# EAGLE design fio_v1.0 (EAGLE 5.00)
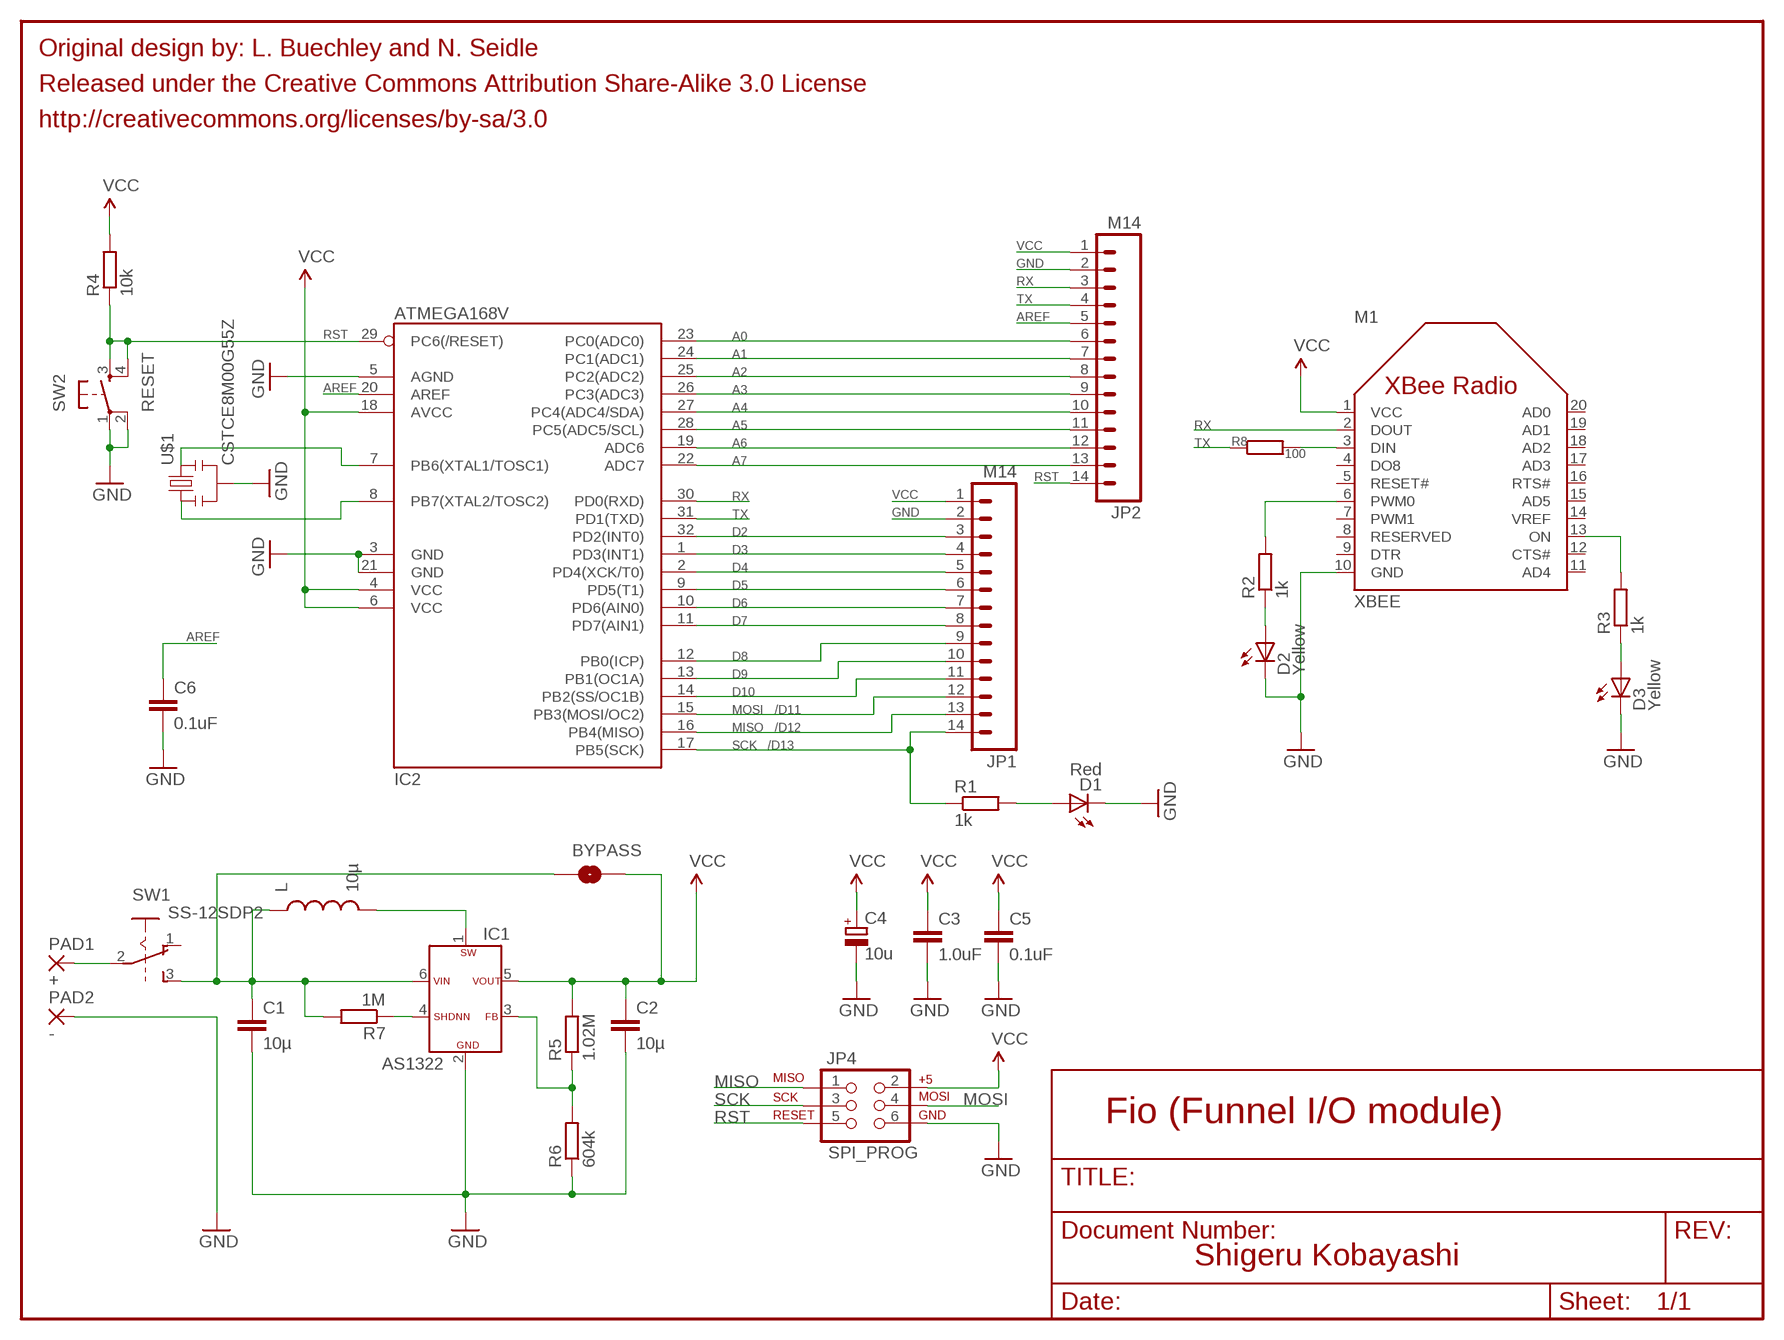
[diagram p0: schematic, sheet 1]

## Parts
BYPASS  SOLDERJUMPERNO  [SJ-NO]
C1  10µ  C-EUC0805K  [C0805K]
C2  10µ  C-EUC0805K  [C0805K]
C3  1.0uF  CAP0603  [0603]
C4  10u  CPOL-EUC  [PANASONIC_C]
C5  0.1uF  CAP0603  [0603]
C6  0.1uF  CAP0603  [0603]
D1  Red  LEDCHIPLED_0805  [CHIPLED_0805]
D2  Yellow  LEDCHIPLED_0805  [CHIPLED_0805]
D3  Yellow  LEDCHIPLED_0805  [CHIPLED_0805]
IC1  AS1322  [SOT23-6]
IC2  ATMEGA168V  ATMEGA168  [TQFP32-08]
JP1  M14  [1X14]
JP2  M14  [1X14]
JP4  SPI_PROG  AVR_SPI_PRG_6NS  [2X3-NS]
L  10µ  A921CY  [D63LCB]
M1  XBEE  [XBEE]
PAD1  +  2,54/1,0  [2,54/1,0]
PAD2  -  2,54/1,0  [2,54/1,0]
R1  1k  R-EU_R0603  [R0603]
R2  1k  R-EU_R0603  [R0603]
R3  1k  R-EU_R0603  [R0603]
R4  10k  R-EU_R0603  [R0603]
R5  1.02M  R-EU_R0603  [R0603]
R6  604k  R-EU_R0603  [R0603]
R7  1M  R-EU_R0603  [R0603]
R8  100  R-EU_R0603  [R0603]
SW1  SS-12SDP2  [SS-12SDP2]
SW2  RESET  OMRON_B3SN-3012  [B3SN-3012]
U$1  CSTCE8M00G55Z  RESONATORSMD  [RESONATOR-SMD]

## Nets
A0: IC2.23(PC0(ADC0)) JP2.6
A1: IC2.24(PC1(ADC1)) JP2.7
A2: IC2.25(PC2(ADC2)) JP2.8
A3: IC2.26(PC3(ADC3)) JP2.9
A4: IC2.27(PC4(ADC4/SDA)) JP2.10
A5: IC2.28(PC5(ADC5/SCL)) JP2.11
A6: IC2.19(ADC6) JP2.12
A7: IC2.22(ADC7) JP2.13
AREF: C6.1 IC2.20(AREF) JP2.5
D2: IC2.32(PD2(INT0)) JP1.3
D3: IC2.1(PD3(INT1)) JP1.4
D4: IC2.2(PD4(XCK/T0)) JP1.5
D5: IC2.9(PD5(T1)) JP1.6
D6: IC2.10(PD6(AIN0)) JP1.7
D7: IC2.11(PD7(AIN1)) JP1.8
D8: IC2.12(PB0(ICP)) JP1.9
D9: IC2.13(PB1(OC1A)) JP1.10
D10: IC2.14(PB2(SS/OC1B)) JP1.11
GND: C1.2 C2.2 C3.2 C4.- C5.2 C6.2 D1.C D2.C D3.C IC1.2(GND) IC2.3(GND) IC2.5(AGND) IC2.21(GND) JP1.2 JP2.2 JP4.6 M1.10(GND) PAD2.1(P) R6.1 SW2.1 SW2.2 U$1.2
MISO: IC2.16(PB4(MISO)) JP1.13 JP4.1
MOSI: IC2.15(PB3(MOSI/OC2)) JP1.12 JP4.4
N$1: M1.13(ON) R3.2
N$2: D1.A R1.2
N$3: D2.A R2.1
N$4: M1.6(PWM0) R2.2
N$5: PAD1.1(P) SW1.2(P)
N$6: D3.A R3.1
N$7: M1.3(DIN) R8.2
N$10: IC2.7(PB6(XTAL1/TOSC1)) U$1.3
N$11: IC1.3(FB) R5.1 R6.2
N$12: IC2.8(PB7(XTAL2/TOSC2)) U$1.1
N$13: BYPASS.1 C1.1 IC1.6(VIN) L.P$1 R7.2 SW1.3(S)
N$14: IC1.1(SW) L.P$2
N$15: IC1.4(SHDNN) R7.1
RST: IC2.29(PC6(/RESET)) JP2.14 JP4.5 R4.1 SW2.3 SW2.4
RX: IC2.30(PD0(RXD)) JP2.3 M1.2(DOUT)
SCK: IC2.17(PB5(SCK)) JP1.14 JP4.3 R1.1
TX: IC2.31(PD1(TXD)) JP2.4 R8.1
VCC [VCC]: BYPASS.2 C2.1 C3.1 C4.+ C5.1 IC1.5(VOUT) IC2.4(VCC) IC2.6(VCC) IC2.18(AVCC) JP1.1 JP2.1 JP4.2 M1.1(VCC) R4.2 R5.2
Unconnected: M1.4(DO8) M1.5(RESET#) M1.7(PWM1) M1.8(RESERVED) M1.9(DTR) M1.11(AD4) M1.12(CTS#) M1.14(VREF) M1.15(AD5) M1.16(RTS#) M1.17(AD3) M1.18(AD2) M1.19(AD1) M1.20(AD0) SW1.1(O)

## Notes on the sheet
- Original design by: L. Buechley and N. Seidle
- Released under the Creative Commons Attribution Share-Alike 3.0 License
- http://creativecommons.org/licenses/by-sa/3.0
- /D11
- /D12
- /D13
- Fio (Funnel I/O module)
- Shigeru Kobayashi

## Library data of the parts
BYPASS = SparkFun:SOLDERJUMPER: Solder Jumper Standard SMD solder jumper. Used to automate production. Two varients : Normally Open and Normally Closed are the same, but have different paste layers. NC will have a large amount of paste and should jumper during reflow.
C1 C2 = rcl:C-EU: CAPACITOR, European symbol
C3 C5 C6 = SparkFun:CAP: Capacitor Standard 0603 ceramic capacitor, and 0.1" leaded capacitor.
C4 = rcl:CPOL-EU: POLARIZED CAPACITOR, European symbol
D1-D3 = led:LED: LED OSRAM: - CHIPLED LG R971, LG N971, LY N971, LG Q971, LY Q971, LO R971, LY R971 LH N974, LH R974 LS Q976, LO Q976, LY Q976 LO Q996 - Hyper CHIPLED LW Q18S LB Q993, LB Q99A, LB R99A - SideLED LS A670, LO A670, LY A670, LG A670, LP A670 LB A673, LV A673, LT A673, LW A673 LH A674 LY A675 LS A676, LA A676, LO A676, LY A676, LW A676 LS A679, LY A679, LG A679 - Hyper Micro SIDELED® LS Y876, LA Y876, LO Y876, LY Y876 LT Y87S - SmartLED LW L88C, LW L88S LB L89C, LB L89S, LG L890 LS L89K, LO L89K, LY L89K LS L896, LA L896, LO L896, LY L896 - TOPLED LS T670, LO T670, LY T670, LG T670, LP T670 LSG T670, LSP T670, LSY T670, LOP T670, LYG T670 LG T671, LOG T671, LSG T671 LB T673, LV T673, LT T673, LW T673 LH T674 LS T676, LA T676, LO T676, LY T676, LB T676, LH T676, LSB T676, LW T676 LB T67C, LV T67C, LT T67C, LS T67K, LO T67K, LY T67K, LW E67C LS E67B, LA E67B, LO E67B, LY E67B, LB E67C, LV E67C, LT E67C LW T67C LS T679, LY T679, LG T679 LS T770, LO T770, LY T770, LG T770, LP T770 LB T773, LV T773, LT T773, LW T773 LH T774 LS E675, LA E675, LY E675, LS T675 LS T776, LA T776, LO T776, LY T776, LB T776 LHGB T686 LT T68C, LB T68C - Hyper Mini TOPLED® LB M676 - Mini TOPLED Santana® LG M470 LS M47K, LO M47K, LY M47K Source: http://www.osram.convergy.de - LUMILED® LXK2-PW12-R00, LXK2-PW12-S00, LXK2-PW14-U00, LXK2-PW14-V00 LXK2-PM12-R00, LXK2-PM12-S00, LXK2-PM14-U00 LXK2-PE12-Q00, LXK2-PE12-R00, LXK2-PE12-S00, LXK2-PE14-T00, LXK2-PE14-U00 LXK2-PB12-K00, LXK2-PB12-L00, LXK2-PB12-M00, LXK2-PB14-N00, LXK2-PB14-P00, LXK2-PB14-Q00 LXK2-PR12-L00, LXK2-PR12-M00, LXK2-PR14-Q00, LXK2-PR14-R00 LXK2-PD12-Q00, LXK2-PD12-R00, LXK2-PD12-S00 LXK2-PH12-R00, LXK2-PH12-S00 LXK2-PL12-P00, LXK2-PL12-Q00, LXK2-PL12-R00 Source: www.luxeon.com
IC1 = austriamicrosystems_as1322:AS1322
IC2 = SparkFun:ATMEGA168
JP1 JP2 = SparkFun:M14: Header 14 Standard 14-pin 0.1" header. Use with straight break away headers (SKU : PRT-00116), right angle break away headers (PRT-00553), swiss pins (PRT-00743), machine pins (PRT-00117), and female headers (PRT-00115).
JP4 = SparkFun:AVR_SPI_PRG_6
L = inductor_toko:A921CY
M1 = digi_xbee:XBEE
PAD1 PAD2 = wirepad:2,54/1,0: THROUGH-HOLE PAD
R1-R8 = rcl:R-EU_: RESISTOR, European symbol
SW1 = nikkai_ss:SS-12S
SW2 = omron_b3sn:OMRON_: Momentary Switch Button commonly used for reset or general input. Spark Fun Electronics SKU : COM-00097
U$1 = SparkFun:RESONATOR: Resonator Small SMD resonator. This is the itty bitty 10/20MHz resonators with built in caps. CSTCE10M0G55 and CSTCE20M0V53. Footprint has been reviewed closely but hasn't been tested yet.

## Net classes
0 Default: width 0.203 mm
1 VCC: width 0.381 mm
2 LEDPower: width 0.203 mm
3 ButtonSignal: width 0.203 mm

## Board
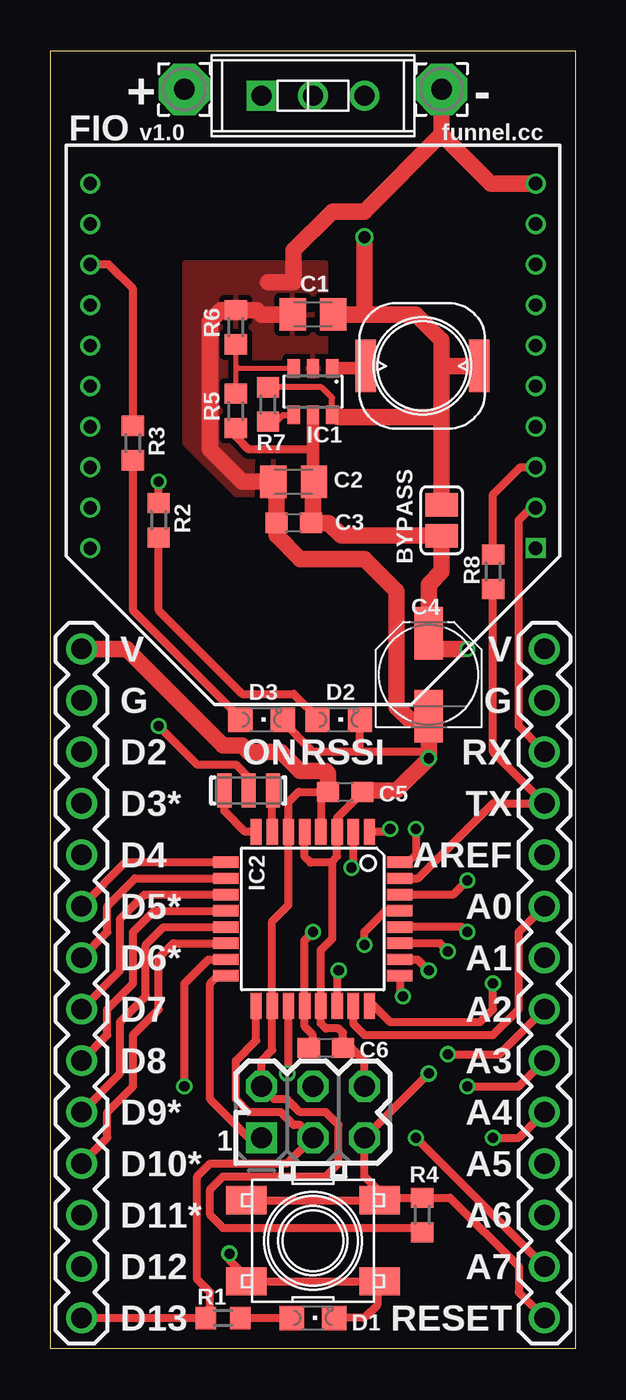
[diagram p1: board, top side]
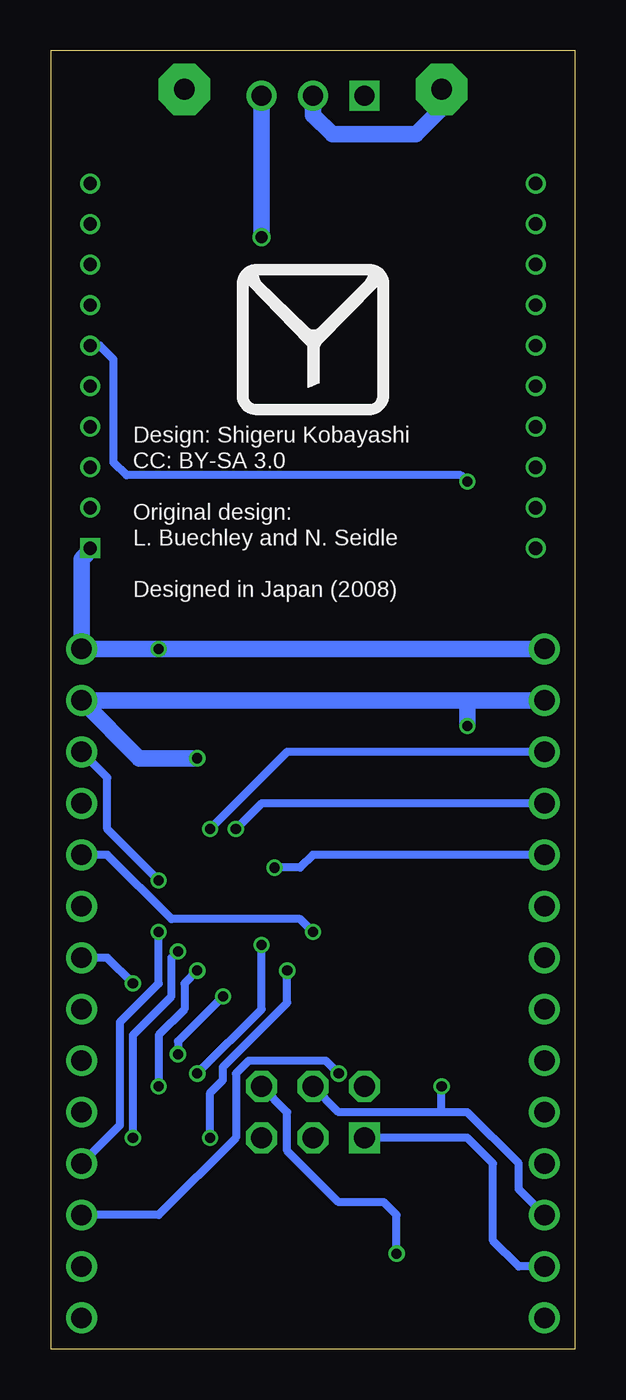
[diagram p2: board, bottom side, seen from below]

Size 25.91 x 64.07 mm. Coordinates in mm from the lower left corner, seen from the top.
Outline: 25.91,64.07 25.91,0 0,0 0,64.07 25.91,64.07
Copper layers (1*16): Top 0.035mm / dielectric 1.5mm / Bottom 0.035mm
Design rules "p_ban_2layer *": minimum track width 5mil, minimum drill 0.3mm, track to track 5mil, track to pad 5mil, pad to pad 5mil, via to via 5mil, smd to smd 5mil, copper to edge 0.5mm, drill to drill 0.3mm, minimum pad ring 0.15mm, minimum via ring 0.15mm, stop-mask expansion 4mil, vias tented up to drill 0.35mm, thermal gap 10mil

### Footprints (pad centres in the part's own frame; a part is rotated, then mirrored left to right if it is on the bottom)
SJ-NO = smd 1.168 x 1.6: 1 -0.762,0; 2 0.762,0
C0805K = smd 1.3 x 1.6: 1 -1,0; 2 1,0
0603 = smd 1.1 x 1: 1 -0.85,0; 2 0.85,0
PANASONIC_C = smd 2.6 x 1.4: + 2.05,0; - -2.05,0
CHIPLED_0805 = smd 1.2 x 1.2: A 0,-1.05; C 0,1.05
SOT23-6 = smd 0.6 x 0.9: 1 -0.95,-1.15; 2 0,-1.15; 3 0.95,-1.15; 4 0.95,1.15; 5 0,1.15; 6 -0.95,1.15
TQFP32-08 = smd 1.27 x 0.559: 1 -4.293,2.8; 2 -4.293,2; 3 -4.293,1.2; 4 -4.293,0.4; 5 -4.293,-0.4; 6 -4.293,-1.2; 7 -4.293,-2; 8 -4.293,-2.8; 17 4.293,-2.8; 18 4.293,-2; 19 4.293,-1.2; 20 4.293,-0.4; 21 4.293,0.4; 22 4.293,1.2; 23 4.293,2; 24 4.293,2.8 | smd 0.559 x 1.27: 9 -2.8,-4.293; 10 -2,-4.293; 11 -1.2,-4.293; 12 -0.4,-4.293; 13 0.4,-4.293; 14 1.2,-4.293; 15 2,-4.293; 16 2.8,-4.293; 25 2.8,4.293; 26 2,4.293; 27 1.2,4.293; 28 0.4,4.293; 29 -0.4,4.293; 30 -1.2,4.293; 31 -2,4.293; 32 -2.8,4.293
1X14 = drill 1.016 round: 1 0,0; 2 2.54,0; 3 5.08,0; 4 7.62,0; 5 10.16,0; 6 12.7,0; 7 15.24,0; 8 17.78,0; 9 20.32,0; 10 22.86,0; 11 25.4,0; 12 27.94,0; 13 30.48,0; 14 33.02,0
2X3-NS = drill 1.016 square: 1 -2.54,-1.27 | drill 1.016 octagon: 2 -2.54,1.27; 3 0,-1.27; 4 0,1.27; 5 2.54,-1.27; 6 2.54,1.27
D63LCB = smd 1 x 2.6: P$1 -2.8,0; P$2 2.8,0
XBEE = drill 0.66 square: 1 -11,9 | drill 0.66 round: 2 -11,7; 3 -11,5; 4 -11,3; 5 -11,1; 6 -11,-1; 7 -11,-3; 8 -11,-5; 9 -11,-7; 10 -11,-9; 11 11,-9; 12 11,-7; 13 11,-5; 14 11,-3; 15 11,-1; 16 11,1; 17 11,3; 18 11,5; 19 11,7; 20 11,9
2,54/1,0 = drill 1.016 pad 2.54 octagon: 1 0,0
R0603 = smd 1 x 1.1: 1 -0.85,0; 2 0.85,0
SS-12SDP2 = drill 1 square: 1 -2.54,0 | drill 1 round: 2 0,0; 3 2.54,0
B3SN-3012 = smd 2 x 1.4: 1 3.3,-2; 2 -3.3,-2; 3 3.3,2; 4 -3.3,2
RESONATOR-SMD = smd 0.7 x 1.7: 1 -1.2,0; 2 0,0; 3 1.2,0

### Placement (x,y rotation side)
BYPASS  19.3,40.89 270 top
C1  12.95,51.05 180 top
C2  12,42.8 180 top
C3  12,40.77 180 top
C4  18.67,33.27 90 top
C5  14.55,27.49 0 top
C6  13.59,14.86 0 top
D1  12.95,1.52 270 top
D2  14.22,31.05 270 top
D3  10.41,31.05 270 top
IC1  12.95,47.24 180 top
IC2  12.94,21.22 270 top
JP1  1.52,34.54 270 top
JP2  24.38,34.54 270 top
JP4  12.95,11.68 0 top
L  18.35,48.51 180 top
M1  12.95,48.51 180 top
PAD1  6.6,62.17 0 top
PAD2  19.3,62.17 0 top
R1  8.51,1.52 0 top
R2  5.33,40.89 90 top
R3  4.06,44.7 90 top
R4  18.35,6.6 270 top
R5  9.14,46.29 270 top
R6  9.14,50.42 270 top
R7  10.73,46.61 90 top
R8  21.84,38.35 90 top
SW1  12.95,61.85 0 top
SW2  12.95,5.33 0 top
U$1  9.78,27.56 0 top
U$2  [FUNNEL_LOGO_BOTTOM]  12.95,49.78 0 top

### Tracks (layer width: path | path; a pad name or v marks a point on that pad's centre or on a via)
A0
  Top 0.406: IC2.23 14.94,16.04 15.49,15.49 21.84,15.49 23.11,16.76 23.11,20.57 JP2.6
A1  (via drill 0.5)
  Top 0.406: IC2.24 15.97,16.93 16.76,16.13 21.21,16.13 21.84,16.76 v21.84,18.03
  Bottom 0.406: JP2.7 23.11,19.3 v21.84,18.03
A2  (via drill 0.5)
  Top 0.406: IC2.25 17.24,17.56 v17.4,17.4 | v19.62,14.54 22.16,14.54 JP2.8
  Bottom 0.406: v17.4,17.4 19.62,15.18 v19.62,14.54
A3  (via drill 0.5)
  Top 0.406: IC2.26 18.12,19.22 v18.67,18.67 | v20.57,12.95 23.11,12.95 JP2.9
  Bottom 0.406: v18.67,18.67 19.3,18.03 19.3,16.76 20.57,15.49 v20.57,12.95
A4  (via drill 0.5)
  Top 0.406: JP2.10 23.11,10.41 v21.84,10.41 | IC2.27 19.22,20.02 v19.62,19.62
  Bottom 0.406: v21.84,10.41 21.84,15.49 19.94,17.4 19.94,19.3 v19.62,19.62
A5  (via drill 0.5)
  Top 0.406: IC2.28 20.33,20.82 v20.57,20.57
  Bottom 0.406: JP2.11 22.48,11.05 22.48,16.13 20.57,18.03 v20.57,20.57
A6  (via drill 0.5)
  Top 0.406: IC2.19 11.74,13.65 v11.68,13.59
  Bottom 0.406: JP2.12 20.57,6.6 16.76,10.41 16.76,13.59 16.13,14.22 12.32,14.22 v11.68,13.59
A7  (via drill 0.5)
  Top 0.406: IC2.22 14.14,18.59 v14.22,18.67 | JP2.13 v18.03,10.41
  Bottom 0.406: v14.22,18.67 14.22,17.08 17.4,13.91 17.4,13.27 18.03,12.64 v18.03,10.41
AREF  (via drill 0.5)
  Top 0.406: C6.1 12.95,14.86 12.95,15.49 12.54,15.9 IC2.20 12.54,20.16 v12.95,20.57
  Bottom 0.406: v12.95,20.57 13.59,21.21 19.94,21.21 23.11,24.38 JP2.5
D2  (via drill 0.5)
  Top 0.406: IC2.32 17.67,24.02 18.03,24.38 v18.03,25.65
  Bottom 0.406: JP1.3 12.95,29.46 | 12.95,29.46 13.59,29.46 | v18.03,25.65 14.22,29.46 12.95,29.46
D3  (via drill 0.5)
  Top 0.406: IC2.1 16.62,25.51 v16.76,25.65
  Bottom 0.406: v16.76,25.65 15.49,26.92 JP1.4
D4  (via drill 0.5)
  Top 0.406: IC2.2 14.94,23.83 v14.86,23.75
  Bottom 0.406: JP1.5 12.95,24.38 13.59,23.75 v14.86,23.75
D5
  Top 0.406: IC2.9 3.7,24.02 JP1.6
D6
  Top 0.406: IC2.10 4.17,23.22 2.79,21.84 2.79,20.57 JP1.7
D7
  Top 0.406: IC2.11 4.64,22.42 3.43,21.21 3.43,18.67 JP1.8
D8
  Top 0.406: IC2.12 5.11,21.62 4.06,20.57 4.06,18.03 2.79,16.76 2.79,15.49 JP1.9
D9
  Top 0.406: IC2.13 5.58,20.82 4.7,19.94 4.7,17.4 3.43,16.13 3.43,13.59 JP1.10
D10
  Top 0.406: IC2.14 6.05,20.02 5.33,19.3 5.33,16.76 4.06,15.49 4.06,12.95 2.79,11.68 2.79,10.41 JP1.11
GND  (via drill 0.5)
  Top 0.406: 11.68,51.05 11.95,51.32 | v5.33,30.73 7.24,28.83 9.14,28.83 9.78,28.19 U$1.2 | 15.42,27.49 15.49,27.56 | 15.42,27.49 C5.2 | 15.42,27.49 14.14,26.21 IC2.3 14.14,24.3 13.91,24.07 | JP4.6 15.49,14.22 14.86,14.86 C6.2 14.44,15.6 14.22,15.81 13.59,15.81 13.34,16.06 IC2.21 13.34,19.69 13.91,20.26 13.91,24.07 | 13.91,24.07 13.84,24 12.83,24 12.54,24.29 IC2.5 | 16.13,3.43 16.03,3.33 SW2.2 9.68,3.33 9.78,3.43 8.83,4.38 v8.83,4.7 | D1.C 15.49,1.52 16.13,2.16 16.13,3.43 | 16.13,3.43 16.22,3.33 SW2.1 | D3.C 11.37,31.05 12.95,29.46 15.18,29.46 | C4.- 18.67,31.37 | D2.C 15.27,29.56 15.18,29.46 | 18.67,29.46 15.18,29.46
  Top 0.813: C1.2 11.68,51.05 10.41,51.05 10.2,51.27 R6.1 8.41,51.27 7.87,50.74 7.87,44.39 9.46,42.8 C2.2 11.05,42.8 11.15,42.7 C3.2 11.15,40.16 12.32,38.99 15.49,38.99 17.08,37.4 17.08,31.69 17.72,31.05 18.67,31.05 | M1.10 21.73,57.51 19.3,59.94 | 19.3,59.94 PAD2.1 | 19.3,59.94 15.49,56.13 13.91,56.13 12,54.23 12,52.64 10.73,52.64 | 18.67,31.05 C4.- | 18.67,31.05 18.67,29.46 v18.67,29.15 17.08,27.56 15.49,27.56
  Bottom 0.406: JP4.6 14.22,11.68 14.22,9.78 11.68,7.24 9.46,7.24 8.83,6.6 v8.83,4.7
  Bottom 0.813: 5.33,32 JP1.2 | 5.33,32 JP2.2 21.53,29.15 v18.67,29.15 | 5.33,32 v5.33,30.73
  pour Top (isolate 0.254): 11.37,42.16 11.37,44.07 9.14,44.07 9.14,47.24 13.59,47.24 13.59,53.59 6.6,53.59 6.6,44.7 9.14,42.16
MISO
  Top 0.406: IC2.16 8.26,18.42 7.87,18.03 7.87,12.32 9.78,10.41 JP4.1
  Bottom 0.406: JP1.13 2.79,4.06 4.06,5.33 4.06,9.14 5.33,10.41 JP4.1
MOSI  (via drill 0.5)
  Top 0.406: IC2.15 7.79,19.22 6.6,18.03 v6.6,12.95
  Bottom 0.406: JP1.12 2.79,7.87 2.79,9.14 5.33,11.68 6.6,11.68 | 6.6,11.68 11.68,11.68 JP4.4 | 6.6,11.68 v6.6,12.95
N$1
  Top 0.406: M1.13 2.87,53.51 4.06,52.32 R3.2
N$2
  Top 0.406: R1.2 D1.A
N$3
  Top 0.406: R2.1 5.33,36.45 9.46,32.32 12,32.32 13.27,31.05 | 13.27,31.05 13.59,31.05 | 13.27,31.05 D2.A
N$4  (via drill 0.5)
  Top 0.406: R2.2 v5.33,42.8
  Bottom 0.406: M1.6 23.48,49.51 22.8,48.83 22.8,43.75 22.16,43.12 5.65,43.12 v5.33,42.8
N$5
  Bottom 0.813: PAD1.1 6.6,61.21 7.87,59.94 12,59.94 12.95,60.9 SW1.2
N$6
  Top 0.406: R3.1 4.06,36.45 9.36,31.15 D3.A
N$7
  Top 0.406: M1.3 23.19,43.51 21.84,42.16 R8.2
N$10
  Top 0.406: U$1.3 11.05,27.56 10.94,27.45 IC2.7
N$11
  Top 0.254: R5.1 9.14,48.51 | 9.14,48.51 9.14,49.47 | IC1.3 9.26,48.39 9.14,48.51
  Top 0.406: R6.2 9.14,49.47 9.25,49.36
N$12
  Top 0.406: U$1.1 8.58,26.54 9.6,25.51 IC2.8
N$13  (via drill 0.6)
  Top 0.305: R7.2 13.37,47.46 13.91,46.93 13.9,46.92 IC1.6
  Top 0.61: IC1.6 14.1,46.09 14.22,45.97
  Top 0.813: BYPASS.1 19.3,45.97 | 19.3,45.97 19.3,48.51 | 19.3,48.51 L.P$1 | 19.3,45.97 14.22,45.97 | 15.49,51.05 18.03,51.05 19.3,49.78 19.3,48.51 | 15.49,51.05 C1.1 | 15.49,51.05 v15.49,54.86
  Bottom 0.813: v15.49,54.86 SW1.3
N$14
  Top 0.406: L.P$2 15.49,48.51 15.37,48.39
  Top 0.61: IC1.1 15.37,48.39
N$15
  Top 0.305: R7.1 11.15,45.76 11.49,46.09 IC1.4
RST  (via drill 0.5)
  Top 0.406: IC2.29 16.54,21.62 15.49,20.57 v15.49,19.94 | v18.67,13.59 JP4.5 15.49,8.51 16.13,7.87 16.13,7.24 | SW2.4 16.03,7.33 16.13,7.24 | 16.13,7.24 16.22,7.33 SW2.3 | 16.13,7.24 16.34,7.45 R4.1 19.72,7.45 23.11,4.06 23.11,2.79 JP2.14
  Bottom 0.406: v15.49,19.94 15.49,16.76 v18.67,13.59
RX  (via drill 0.5)
  Top 0.406: IC2.30 19.88,22.42 v20.57,23.11 | JP2.3 23.11,30.73 23.11,40.89 23.73,41.51 M1.2
  Bottom 0.406: v20.57,23.11 23.11,25.65 23.11,28.19 JP2.3
SCK
  Top 0.406: IC2.17 10.14,15.22 9.14,14.22 9.14,12.32 9.78,11.68 11.37,11.68 12,11.05 12.32,11.05 JP4.3 11.68,9.14 7.87,9.14 7.24,8.51 7.24,3.43 7.87,2.79 7.87,1.52 R1.1 | R1.1 7.66,1.74 | JP1.14 R1.1
TX
  Top 0.406: R8.1 21.84,29.46 JP2.4 21.84,26.92 18.14,23.22 IC2.31
VCC  (via drill 0.5)
  Top 0.406: R5.2 9.14,45.02 9.78,44.39 12.95,44.39 | IC2.4 13.34,27.31 13.59,27.56 13.66,27.49 C5.1 12.25,27.49 11.74,26.98 IC2.6 11.74,21.9 10.94,21.1 IC2.18 10.94,14.75 10.41,14.22 JP4.2 11.05,12.32 11.68,12.32 12.32,11.68 13.59,11.68 14.22,11.05 14.22,9.14 13.59,8.51 8.51,8.51 7.87,7.87 7.87,6.6 8.51,5.97 18.35,5.97 R4.2 | 18.99,34.54 18.67,34.86 18.67,35.18 C4.+
  Top 0.61: 12.95,42.8 12.95,44.39 IC1.5
  Top 0.813: C2.1 12.95,42.8 12.95,40.77 C3.1 13.72,40.77 14.35,40.13 BYPASS.2 19.3,38.35 18.67,37.72 18.67,35.18 | C5.1 13.7,28.4 13.59,28.51 12.32,28.51 11.37,29.46 9.78,29.46 9.46,29.78 8.51,29.78 3.75,34.54 JP1.1 | v20.57,34.54 18.99,34.54
  Bottom 0.406: 23.75,39.62 23.86,39.51 M1.1
  Bottom 0.813: 23.86,39.51 24.38,38.99 JP2.1 v20.57,34.54 JP1.1

### Text on the board
tPlace: + | - | FIO | v1.0 | funnel.cc | V | V | G | G | RX | D2 | ON | RSSI | TX | D3* | AREF | D4 | A0 | D5* | A1 | D6* | A2 | D7 | A3 | D8 | A4 | D9* | 1 | A5 | D10* | A6 | D11* | A7 | D12 | RESET | D13
bPlace: Design: Shigeru Kobayashi | CC: BY-SA 3.0 | Original design: | L. Buechley and N. Seidle | Designed in Japan (2008)